# EAGLE design mixtape (EAGLE 6.5.0)

## Sheet 1 of 2
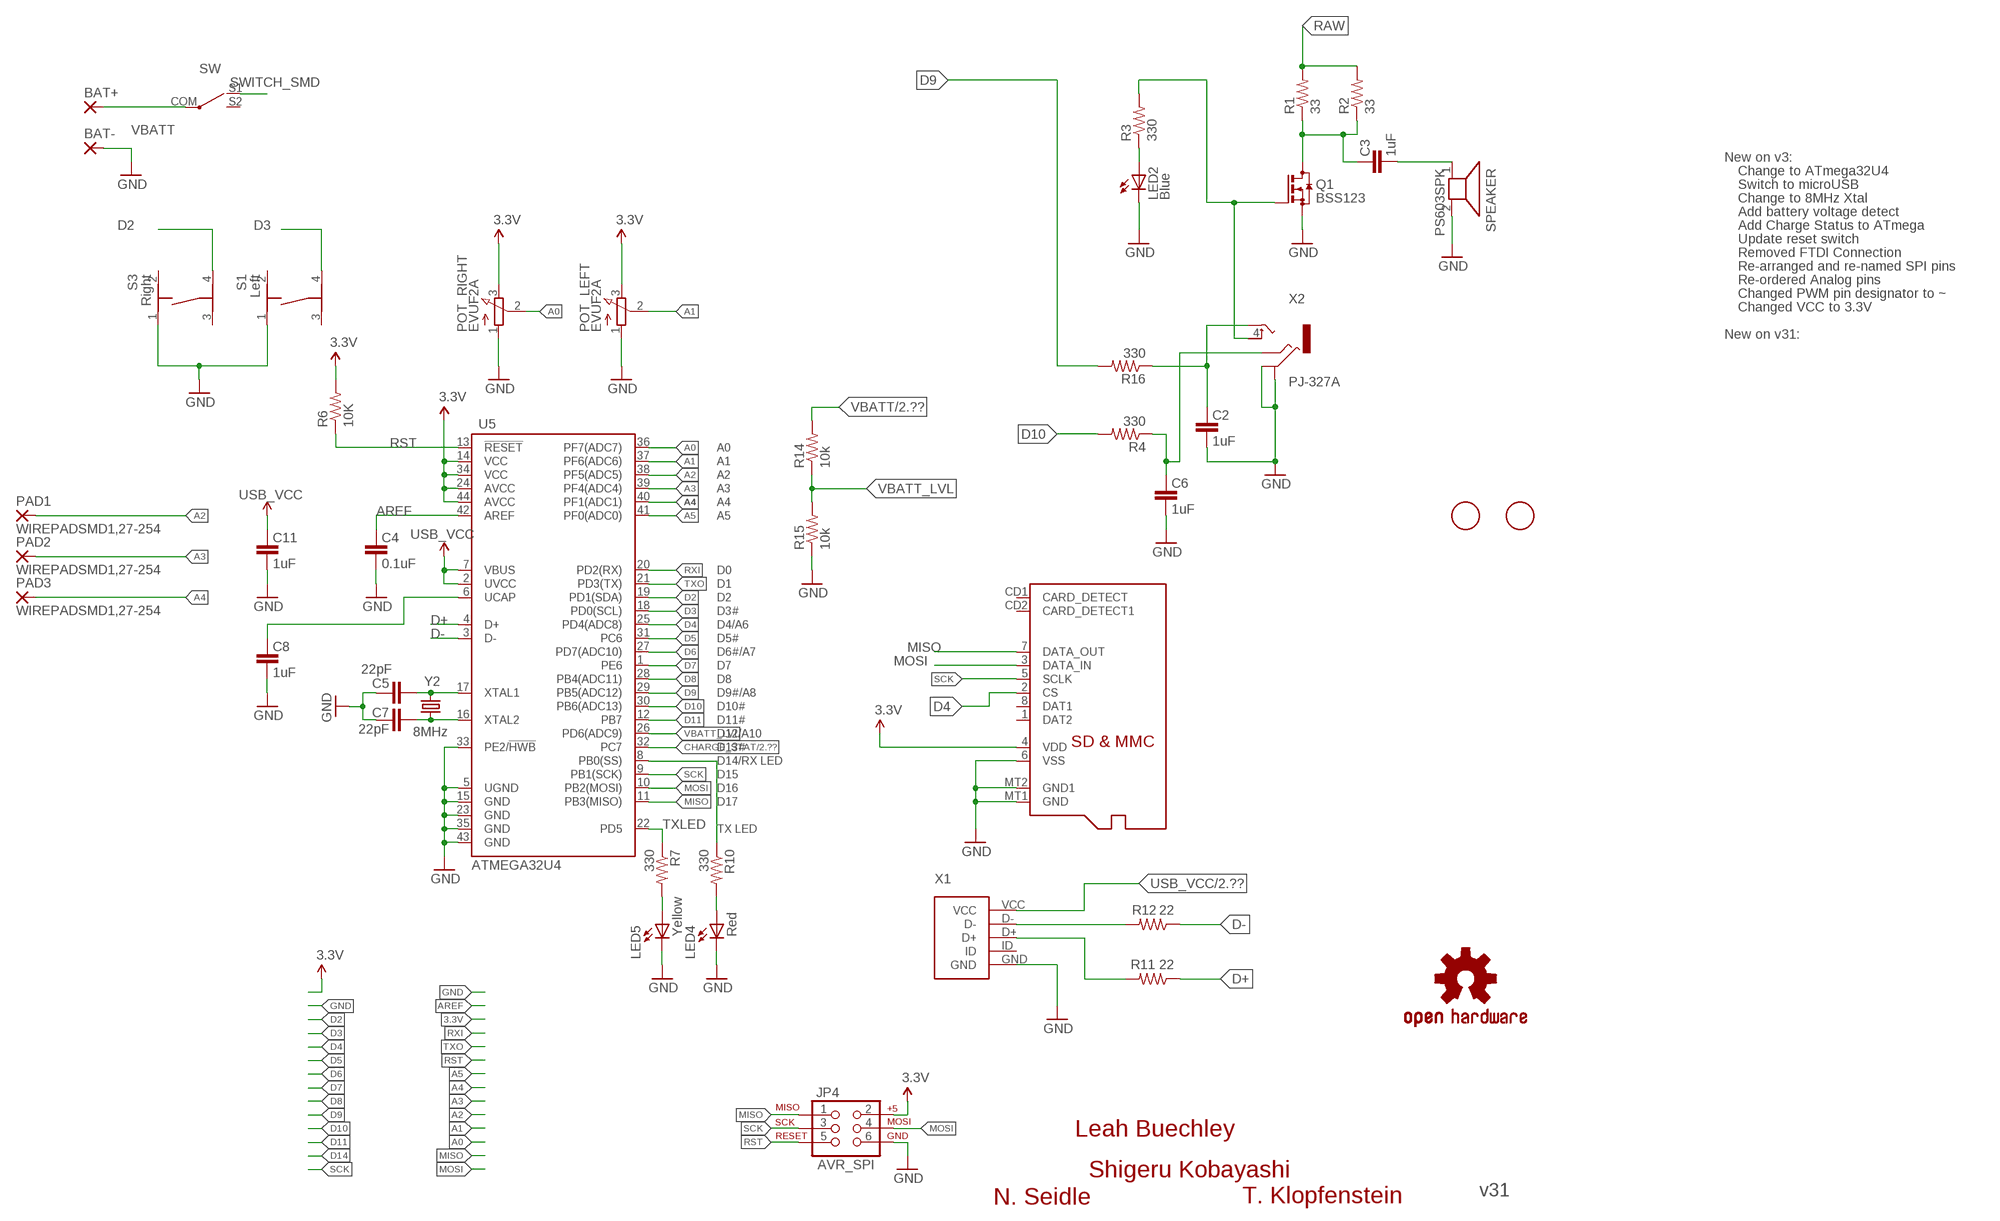
[diagram p0: schematic, sheet 1]

### Parts
BAT+  SMD5  [SMD2,54-5,08]
BAT-  SMD5  [SMD2,54-5,08]
C2  1uF  CAP0603-CAP  [0603-CAP]
C3  1uF  CAP0603-CAP  [0603-CAP]
C4  0.1uF  CAP0603-CAP  [0603-CAP]
C5  22pF  CAP0603-CAP  [0603-CAP]
C6  1uF  CAP0603-CAP  [0603-CAP]
C7  22pF  CAP0603-CAP  [0603-CAP]
C8  1uF  CAP0603-CAP  [0603-CAP]
C11  1uF  CAP0603-CAP  [0603-CAP]
JP4  AVR_SPI  AVR_SPI_PRG_6PTH  [2X3]
LED2  Blue  LED0603  [LED-0603]
LED4  Red  LED0603  [LED-0603]
LED5  Yellow  LED0603  [LED-0603]
LOGO1  OSHW-LOGOL  [OSHW-LOGO-L]
PAD1  WIREPADSMD1,27-254  [SMD1,27-2,54]
PAD2  WIREPADSMD1,27-254  [SMD1,27-2,54]
PAD3  WIREPADSMD1,27-254  [SMD1,27-2,54]
POT_LEFT  EVUF2A  [EVUF]
POT_RIGHT  EVUF2A  [EVUF]
Q1  BSS123  [SOT23]
R1  33  RESISTOR0603-RES  [0603-RES]
R2  33  RESISTOR0603-RES  [0603-RES]
R3  330  RESISTOR0603-RES  [0603-RES]
R4  330  RESISTOR0603-RES  [0603-RES]
R6  10K  RESISTOR0603-RES  [0603-RES]
R7  330  RESISTOR0603-RES  [0603-RES]
R10  330  RESISTOR0603-RES  [0603-RES]
R11  22  RESISTOR0603-RES  [0603-RES]
R12  22  RESISTOR0603-RES  [0603-RES]
R14  10k  RESISTOR0603-RES  [0603-RES]
R15  10k  RESISTOR0603-RES  [0603-RES]
R16  330  RESISTOR0603-RES  [0603-RES]
S1  Left  TASTER-9314_SMD  [TASTER-9314_SMD]
S3  Right  TASTER-9314_SMD  [TASTER-9314_SMD]
SD  MICROSD  [MICROSD]
SPEAKER  PS603SPK  [PS603]
SW  SWITCH_SMD  [SWITCH_SMD]
U5  ATMEGA32U4  ATMEGA32U41:1  [QFN-44-NOPAD_1:1]
U$1  FIDUCIAL  [FIDUCIAL_1MM]
U$2  FIDUCIAL  [FIDUCIAL_1MM]
X1  USB_B_SMD  [USB_B_SMD]
X2  PJ-327A  [PJ-327A]
Y2  8MHz  CRYSTAL5X3  [CRYSTAL-SMD-5X3]

### Nets
3.3V [vcc]: JP4.2 POT_LEFT.3(E) POT_RIGHT.3(E) R6.2 SD.4(VDD) U5.14(VCC) U5.24(AVCC) U5.34(VCC) U5.44(AVCC) ; also sheet 2
A0: POT_RIGHT.2(S) U5.36(PF7(ADC7))
A1: POT_LEFT.2(S) U5.37(PF6(ADC6))
A2: PAD1.1(P) U5.38(PF5(ADC5))
A3: PAD2.1(P) U5.39(PF4(ADC4))
A4: PAD3.1(P) U5.40(PF1(ADC1))
A5: U5.41(PF0(ADC0))
AREF: C4.2 U5.42(AREF)
CHARGE_STAT: U5.32(PC7) ; also sheet 2
D2: S3.4 U5.19(PD1(SDA))
D3: S1.4 U5.18(PD0(SCL))
D4: SD.2(CS) U5.25(PD4(ADC8))
D5: U5.31(PC6)
D6: U5.27(PD7(ADC10))
D7: U5.1(PE6)
D8: U5.28(PB4(ADC11))
D9: R16.2 U5.29(PB5(ADC12))
D10: R4.2 U5.30(PB6(ADC13))
D11: U5.12(PB7)
D14: R10.1 U5.8(PB0(SS))
D+: R11.1 U5.4(D+)
D-: R12.1 U5.3(D-)
GND: BAT-.1(P) C2.1 C4.1 C5.2 C6.1 C7.2 C8.1 C11.1 JP4.6 LED2.C LED4.C LED5.C POT_LEFT.1(A) POT_RIGHT.1(A) Q1.2(S) R15.1 S1.1 S3.1 SD.6(VSS) SD.MT1(GND) SD.MT2(GND1) SPEAKER.2 U5.5(UGND) U5.15(GND) U5.23(GND) U5.33(PE2/!HWB) U5.35(GND) U5.43(GND) X1.GND X2.1 X2.5 ; also sheet 2
MISO: JP4.1 SD.7(DATA_OUT) U5.11(PB3(MISO))
MOSI: JP4.4 SD.3(DATA_IN) U5.10(PB2(MOSI))
N$2 [vcc]: C3.2 Q1.3(D) R1.1 R2.1
N$3: C3.1 SPEAKER.1
N$4: C6.2 R4.1 X2.3
N$5: R11.2 X1.D+
N$6: LED2.A R3.1
N$7: Q1.1(G) R3.2 X2.4
N$15: LED5.A R7.2
N$16: C7.1 U5.16(XTAL2) Y2.1
N$17: C5.1 U5.17(XTAL1) Y2.3
N$19: LED4.A R10.2
N$20: R12.2 X1.D-
N$21: C2.2 R16.1 X2.2
RAW [vcc]: R1.2 R2.2 SW.S1 ; also sheet 2
RST: JP4.5 R6.1 U5.13(!RESET)
RXI: U5.20(PD2(RX))
SCK: JP4.3 SD.5(SCLK) U5.9(PB1(SCK))
TXLED: R7.1 U5.22(PD5)
TXO: U5.21(PD3(TX))
UCAP: C8.2 U5.6(UCAP)
USB_VCC: C11.2 U5.2(UVCC) U5.7(VBUS) X1.VCC ; also sheet 2
VBATT: BAT+.1(P) R14.2 SW.COM ; also sheet 2
VBATT_LVL: R14.1 R15.2 U5.26(PD6(ADC9))
Unconnected: S1.2 S1.3 S3.2 S3.3 SD.1(DAT2) SD.8(DAT1) SD.CD1(CARD_DETECT) SD.CD2(CARD_DETECT1) SW.S2 X1.ID

### Notes on the sheet
- New on v3:
- Change to ATmega32U4
- Switch to microUSB
- Change to 8MHz Xtal
- Add battery voltage detect
- Add Charge Status to ATmega
- Update reset switch
- Removed FTDI Connection
- Re-arranged and re-named SPI pins
- Re-ordered Analog pins
- Changed PWM pin designator to ~
- Changed VCC to 3.3V
- New on v31:
- Leah Buechley
- Shigeru Kobayashi
- v31
- N. Seidle | T. Klopfenstein

## Sheet 2 of 2
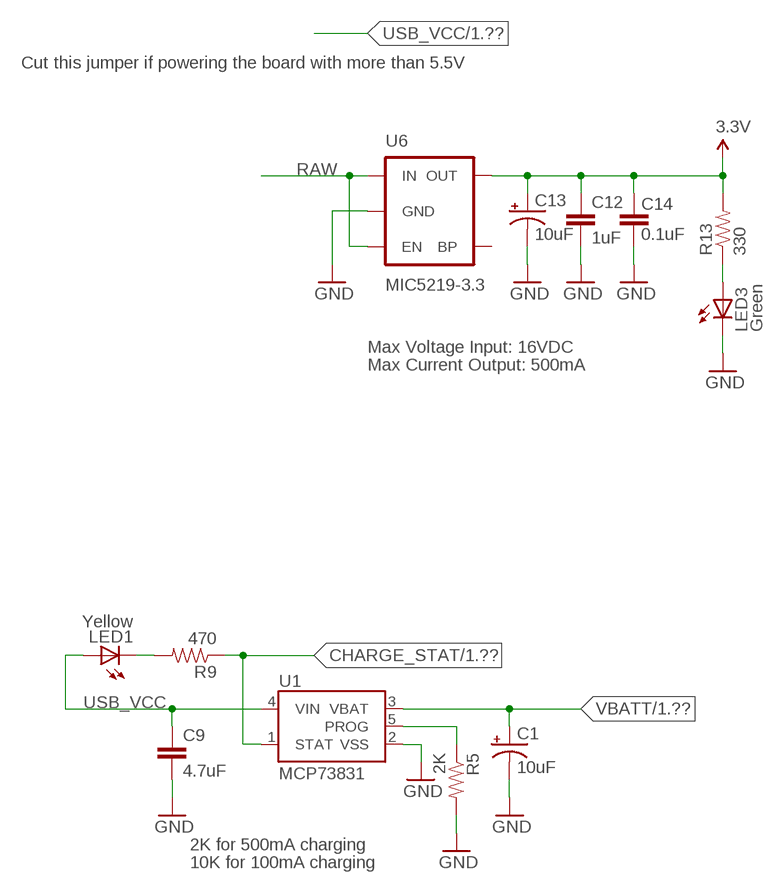
[diagram p1: schematic, sheet 2]

### Parts
C1  10uF  CAP_POL1206  [EIA3216]
C9  4.7uF  CAP0603-CAP  [0603-CAP]
C12  1uF  CAP0603-CAP  [0603-CAP]
C13  10uF  CAP_POL1206  [EIA3216]
C14  0.1uF  CAP0603-CAP  [0603-CAP]
LED1  Yellow  LED0603  [LED-0603]
LED3  Green  LED0603  [LED-0603]
R5  2K  RESISTOR0603-RES  [0603-RES]
R9  470  RESISTOR0603-RES  [0603-RES]
R13  330  RESISTOR0603-RES  [0603-RES]
U1  MCP73831  [SOT23-5]
U6  MIC5219-3.3  V_REG_LDOSMD  [SOT23-5]

### Nets
3.3V [vcc]: C12.1 C13.A(+) C14.2 R13.2 U6.5(OUT) ; also sheet 1
CHARGE_STAT: R9.1 U1.1(STAT) ; also sheet 1
GND: C1.C(-) C9.2 C12.2 C13.C(-) C14.1 LED3.C R5.2 U1.2(VSS) U6.2(GND) ; also sheet 1
N$8: LED1.C R9.2
N$11: R5.1 U1.5(PROG)
N$38: LED3.A R13.1
RAW [vcc]: U6.1(IN) U6.3(EN) ; also sheet 1
USB_VCC: C9.1 LED1.A U1.4(VIN) ; also sheet 1
VBATT: C1.A(+) U1.3(VBAT) ; also sheet 1
Unconnected: U6.4(BP)

### Notes on the sheet
- Cut this jumper if powering the board with more than 5.5V
- Max Voltage Input: 16VDC
- Max Current Output: 500mA
- 2K for 500mA charging
- 10K for 100mA charging

## Library data of the parts
BAT+ BAT- = wirepad:SMD5: SMD PAD
C1 C13 = SparkFun:CAP_POL: Capacitor Polarized These are standard SMD and PTH capacitors. Normally 10uF, 47uF, and 100uF in electrolytic and tantalum varieties. Always verify the external diameter of the through hole cap, it varies with capacity, voltage, and manufacturer. The EIA devices should be standard.
C2-C9 C11 C12 C14 = SparkFun-Capacitors:CAP: Capacitor Standard 0603 ceramic capacitor, and 0.1" leaded capacitor.
JP4 = SparkFun:AVR_SPI_PRG_6: AVR ISP 6 Pin This is the reduced ISP connector for AVR programming. Common on Arduino. This footprint will take up less PCB space and can be used with a 10-pin to 6-pin adapter such as SKU: BOB-08508
LED1-LED5 = SparkFun:LED: LEDs Standard schematic elements and footprints for 5mm, 3mm, 1206, and 0603 sized LEDs. 5mm - Spark Fun Electronics SKU : COM-00529 (and others)
LOGO1 = SparkFun-Aesthetics:OSHW-LOGO: Open Source Hardware Logo This logo indicates the piece of hardware it is found on incorporates a OSHW license and/or adheres to the definition of open source hardware found here: http://freedomdefined.org/OSHW
PAD1-PAD3 = wirepad:WIREPAD: Wire PAD connect wire on PCB
POT_LEFT POT_RIGHT = Gaudi:EVU: 9 mm Square Rotary Potentiometers Source: Panasonic
Q1 = transistor-small-signal:BSS123: N-CHANNEL MOS FET
R1-R7 R9-R16 = SparkFun-Resistors:RESISTOR: Resistor Basic schematic elements and footprints for 0603, 1206, and PTH resistors.
S1 S3 = Gaudi:TASTER-9314_SMD; PN: UG_SW
SD = adafruit:MICROSD: Micro-SD / Transflash card holder with SPI pinout For the 3M # 2908-05WB-MG and/or 4UCON #19656 push-push type
SPEAKER = adafruit:PS603: PS603 Small 8 ohm speaker, from Mouser. Can SMT solder to board http://www.ladyada.net/library/pcb/eaglelibrary.html
SW = Gaudi:SWITCH_SMD
U1 = SparkFun:MCP73831: Microchip's MCP73831 Miniature single cell, fully integrated Li-Ion, Li-polymer charge management controller http://ww1.microchip.com/downloads/en/DeviceDoc/21984a.pdf
U5 = Testing:ATMEGA32U4: Atmel 44-pin 8-bit Microcontroller with 32KBytes of ISP Flash and USB Controller
U6 = SparkFun:V_REG_LDO: Voltage Regulator LDO Standard 150mA LDO voltage regulator in SOT-23 layout. Micrel part MIC5205. BP (by-pass) pin is used to lower output noise with 470pF cap.
U$1 U$2 = adafruit:FIDUCIAL: For use by pick and place machines to calibrate the vision/machine, 1mm By microbuilder.eu
X1 = Gaudi:USB_B_SMD
X2 = Gaudi:PJ-327A
Y2 = SparkFun:CRYSTAL: Crystals Various standard crystals. Proven footprints. Spark Fun Electronics SKU : COM-00534

## Net classes
0 Default: width 0.203 mm
2 LEDPower: width 0.203 mm
3 ButtonSignal: width 0.203 mm

## Board
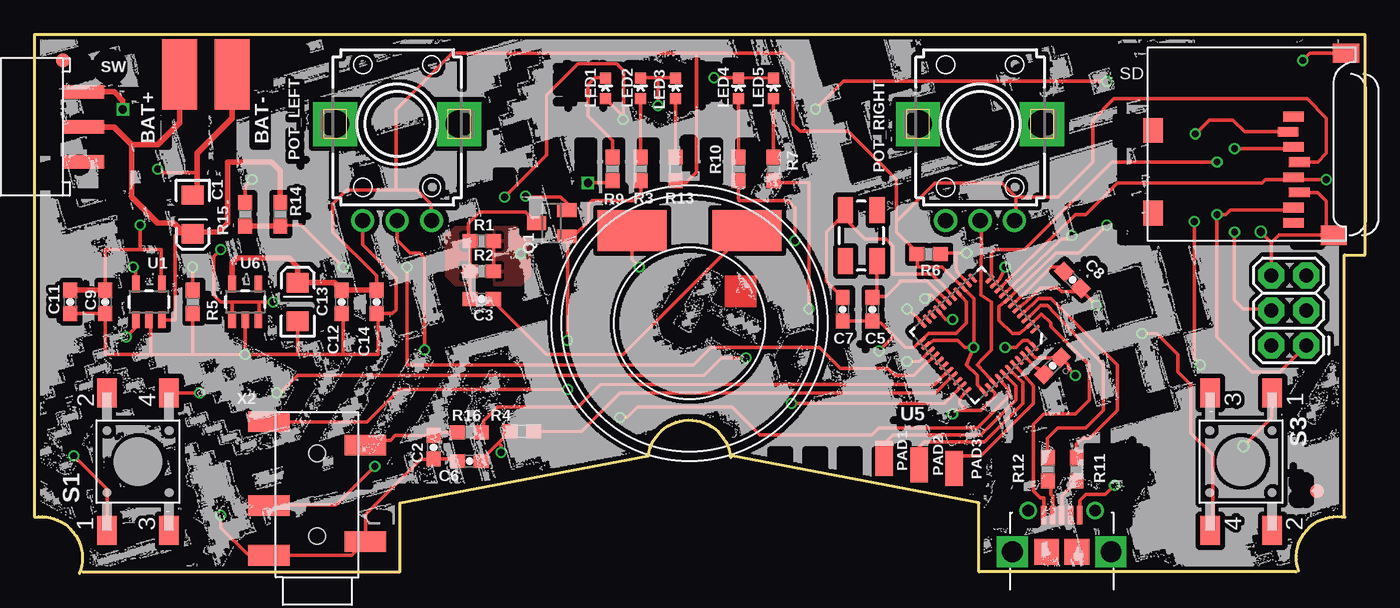
[diagram p2: board, top side]
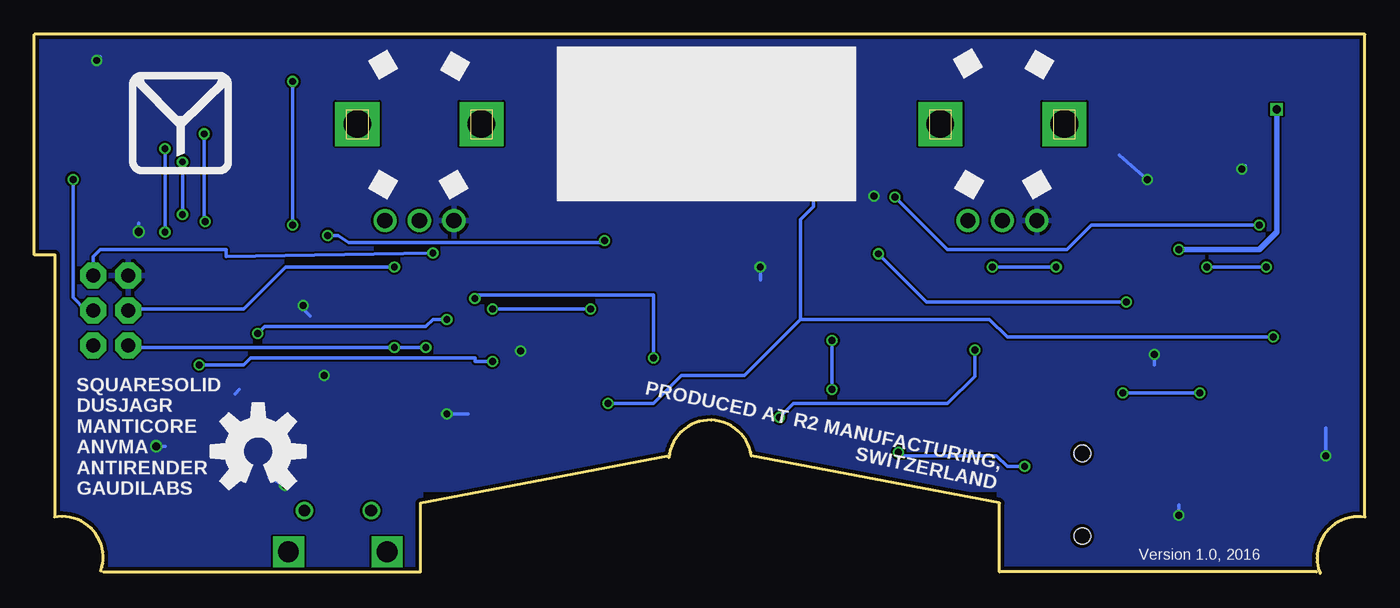
[diagram p3: board, bottom side, seen from below]

Size 96.51 x 39.12 mm. Coordinates in mm from the lower left corner, seen from the top.
Outline: 0.01,4.12 0.01,39.12 96.51,39.12 96.51,23.12 95.01,23.12 95.01,4.12
Outline: 44.5,8.53 26.51,5.12 26.51,0.12 3.51,0.12
Outline: 50.6,8.53 68.51,5.12 68.51,0.12 91.51,0.12
Outline: 0,4.09 arc-121 3.26,0
Outline: 91.7,0.17 arc-120 95.07,4.09
Outline: 44.52,8.52 arc-167 50.49,8.41
Copper layers (1*2*15*16): Top 0.035mm / dielectric 0.2mm / Route2 0.0175mm / dielectric 1.1mm / Route15 0.0175mm / dielectric 0.2mm / Bottom 0.035mm
Design rules "SeeedStudio_DRU_no_angle_20130527": minimum track width 6mil, minimum drill 12mil, track to track 6mil, track to pad 6mil, pad to pad 6mil, via to via 6mil, smd to smd 0mil, copper to edge 10mil, drill to drill 10mil, minimum pad ring 6mil, minimum via ring 6mil, stop-mask expansion 2mil, vias tented up to drill 25mil, thermal gap 10mil

### Footprints (pad centres in the part's own frame; a part is rotated, then mirrored left to right if it is on the bottom)
SMD2,54-5,08 = smd 2.54 x 5.08: 1 0,0
EIA3216 = smd 1.4 x 1.6: A 1.4,0; C -1.4,0
0603-CAP = smd 1.1 x 1: 1 -0.85,0; 2 0.85,0
2X3 = drill 1.016 pad 1.88 octagon: 1 0,0; 2 0,2.54; 3 2.54,0; 4 2.54,2.54; 5 5.08,0; 6 5.08,2.54
LED-0603 = smd 0.8 x 0.8: A 0,-0.75; C 0,0.75
SMD1,27-2,54 = smd 1.27 x 2.54: 1 0,0
EVUF = drill 1.1 pad 1.676: 1 -2.5,-7; 2 0,-7; 3 2.5,-7 | drill 2 pad 3.2 square: M1 4.5,0; M2 -4.5,0
SOT23 = smd 1 x 1.4: 1 -0.95,-1.1; 2 0.95,-1.1; 3 0,1.1
0603-RES = smd 1.1 x 1: 1 -0.85,0; 2 0.85,0
TASTER-9314_SMD = smd 2.1 x 1.4: 1 -5,2.25; 2 5,2.25; 3 -5,-2.25; 4 5,-2.25
MICROSD = smd 0.7 x 1.5: 1 9,-10.64; 2 7.9,-10.24; 3 6.8,-10.64; 4 5.7,-11.04; 5 4.6,-10.64; 6 3.5,-11.04; 7 2.4,-10.64; 8 1.3,-10.64 | smd 1.8 x 1.4: CD1 2,-0.44; CD2 8,-0.44 | smd 1.4 x 1.9: MT1 0.4,-13.54; MT2 13.6,-14.44
PS603 = smd 5 x 3: 1 -4.184,-6.738; 2 4.184,-6.738
SWITCH_SMD = smd 3 x 1: COM 0,0; S1 0,2.54; S2 0,-2.54
SOT23-5 = smd 0.55 x 1.2: 1 -0.95,-1.3; 2 0,-1.3; 3 0.95,-1.3; 4 0.95,1.3; 5 -0.95,1.3
QFN-44-NOPAD_1:1 = smd 0.8 x 0.3: 1 -3.337,2.458; 2 -3.337,1.958; 3 -3.337,1.479; 4 -3.337,0.979; 5 -3.337,0.5; 6 -3.337,0; 7 -3.337,-0.5; 8 -3.337,-0.979; 9 -3.337,-1.479; 10 -3.337,-1.958; 11 -3.337,-2.458; 23 3.337,-2.458; 24 3.337,-1.958; 25 3.337,-1.479; 26 3.337,-0.979; 27 3.337,-0.5; 28 3.337,0; 29 3.337,0.5; 30 3.337,0.979; 31 3.337,1.479; 32 3.337,1.958; 33 3.337,2.458 | smd 0.3 x 0.8: 12 -2.458,-3.337; 13 -1.958,-3.337; 14 -1.479,-3.337; 15 -0.979,-3.337; 16 -0.5,-3.337; 17 0,-3.337; 18 0.5,-3.337; 19 0.979,-3.337; 20 1.479,-3.337; 21 1.958,-3.337; 22 2.458,-3.337; 34 2.458,3.337; 35 1.958,3.337; 36 1.479,3.337; 37 0.979,3.337; 38 0.5,3.337; 39 0,3.337; 40 -0.5,3.337; 41 -0.979,3.337; 42 -1.479,3.337; 43 -1.958,3.337; 44 -2.458,3.337
FIDUCIAL_1MM = smd 1 x 1: 1 0,0
USB_B_SMD = smd 0.4 x 1.35: D+ 0,0; D- -0.65,0; GND 1.3,0; ID 0.65,0; VCC -1.3,0 | smd 1.8 x 1.9: P$6 -1.1,-2.675; P$7 1.1,-2.675 | drill 0.85: P$8 -2.425,0.325; P$9 2.425,0.325 | drill 1.5 pad 2 square: P$10 -3.575,-2.675; P$11 3.575,-2.675
PJ-327A = smd 1.5 x 3: 1 2.6,-3.5; 2 9.6,-3.5; 3 5.2,3.5; 4 11.3,3.5; 5 1.6,3.5 | hole 1.2: 3,0; 9,0
CRYSTAL-SMD-5X3 = smd 1.9 x 1.1: 1 -1.85,-1.15; 2 1.85,-1.15; 3 1.85,1.15; 4 -1.85,1.15

### Placement (x,y rotation side)
BAT+  10.53,36.22 0 top
BAT-  14.34,36.22 0 top
C1  11.48,26.06 270 top
C2  28.94,9.17 90 top
C3  32.44,19.91 180 top
C4  73.85,15.07 225 top
C5  60.78,19.17 270 top
C6  31.55,8.15 0 top
C7  58.62,19.17 270 top
C8  75.29,21.3 135 top
C9  5.13,19.71 270 top
C11  2.59,19.71 90 top
C12  22.28,19.71 270 top
C13  19.1,19.71 90 top
C14  24.82,19.71 90 top
JP4  92.26,16.56 90 top
LED1  41.42,35.21 0 top
LED2  43.96,35.21 0 top
LED3  46.5,35.21 0 top
LED4  51.07,35.21 0 top
LED5  53.61,35.21 0 top
LOGO1  80.29,8.87 0 bottom
PAD1  61.65,8.34 0 top
PAD2  64.19,7.9 0 top
PAD3  66.73,7.64 0 top
POT_LEFT  26.31,32.62 0 top
POT_RIGHT  68.59,32.62 0 top
Q1  37.52,25.42 90 top
R1  32.44,24.12 0 top
R2  32.44,21.93 0 top
R3  43.96,29.37 270 top
R4  35.36,10.31 0 top
R5  11.48,19.71 270 top
R6  64.85,23.18 180 top
R7  53.61,29.37 90 top
R9  41.93,29.37 90 top
R10  51.07,29.37 90 top
R11  75.59,7.57 270 top
R12  73.5,7.57 270 top
R13  46.5,29.37 270 top
R14  17.83,26.06 90 top
R15  15.29,26.06 270 top
R16  31.55,10.25 0 top
S1  7.51,8.12 90 top
S3  87.51,8.12 270 top
SD  80.7,24.15 90 top
SPEAKER  47.51,18.15 180 top
SW  3.54,32.41 0 top
U1  8.31,19.71 0 top
U5  68.46,17.3 222 top
U6  15.29,19.71 0 top
U$1  2.08,37.24 0 top
U$2  93.02,5.99 0 top
U$4  FIO_LOGOV2  [FUNNEL_LOGO_BOTTOM_V2]  85.9,32.66 0 top
X1  74.51,4.25 0 top
X2  20.51,-0.28 90 top
Y2  59.97,24.52 270 top

### Tracks (layer width: path | path; a pad name or v marks a point on that pad's centre or on a via)
3.3V  (via drill 0.5)
  Top 0.2: 91.75,29.87 SD.4
  Top 0.254: 68.12,16.46 v68.12,16.41 67.49,16.41 66.98,16.92 65.2,16.92 U5.24 | 68.12,16.46 68.12,19.97 U5.14 65.84,22.25 64.06,22.25 64.06,23.12 R6.2 63.81,23.01 63.81,23.52 62.54,24.79 62.54,25.55 | 68.12,16.46 67.62,15.14 68.38,14.38 68.38,13.69 U5.34 | 62.54,25.55 65.33,28.35 70.16,28.35 71.17,27.33 | 71.17,27.33 71.17,25.7 POT_RIGHT.3 | 62.54,25.55 62.54,28.6 59.01,32.12 55.51,32.12 55.01,32.62 55.01,37.12 54.39,37.74 48.01,37.74 | v70.41,16.41 71.17,16.41 71.68,16.92 72.07,16.92 U5.44 | 71.17,27.33 74.22,27.33 76.76,29.87 76.76,32.92 78.28,34.44 92.32,34.44 93.71,33.04 93.71,30.5 93.08,29.87 91.75,29.87 | 48.01,37.74 30.28,37.74 26.21,33.68 26.21,27.84 | C14.2 24.82,21.61 21.64,24.79 21.64,26.82 22.66,27.84 26.21,27.84 | 26.21,27.84 27.74,27.84 28.75,26.82 28.75,25.68 POT_LEFT.3 | R13.2 46.67,28.35 47.26,28.35 48.03,29.12 48.03,37.73 48.01,37.74
  Top 0.406: U6.5 14.34,22.57 14.66,22.88 18.47,22.88 19.1,22.25 C13.A 21.73,21.11 C12.1 C14.2
  Bottom 0.254: v68.12,16.41 v70.41,16.41 89.57,16.41 JP4.2
A0
  Top 0.254: U5.36 68.96,14.56 68.38,15.14 68.6,15.43 69.39,16.22 69.39,19.71 68.67,20.22 68.67,25.58 POT_RIGHT.2
A1  (via drill 0.5)
  Top 0.254: U5.37 70.47,13.55 70.66,13.36 70.66,12.85 68.38,10.57 61.27,10.57 60.76,10.06 52.63,10.06 50.6,12.09 43.74,12.09 42.98,11.33 v42.47,11.33 | POT_LEFT.2 26.31,24.18 27.23,23.27 27.93,23.27 28.31,22.88 v28.31,16.22
  Bottom 0.254: v28.31,16.22 28.31,14.31 30.28,12.34 41.45,12.34 v42.47,11.33
A2
  Top 0.254: U5.38 70.32,14.47 71.17,13.61 71.17,12.6 68.63,10.06 62.28,10.06 61.77,9.55 61.77,7.77 PAD1.1
A3
  Top 0.254: U5.39 71.23,14.32 71.68,13.87 71.68,12.34 68.89,9.55 64.57,9.55 64.06,9.04 64.06,7.77 PAD2.1
A4
  Top 0.254: U5.40 71.57,14.61 72.44,13.61 72.44,12.34 68.63,8.53 66.85,8.53 66.6,8.28 PAD3.1
AREF
  Top 0.254: U5.42 71.79,15.79 72.7,14.88 72.84,14.88 C4.2
CHARGE_STAT  (via drill 0.5, 0.6)
  Top 0.254: 67.03,13.41 U5.32 66.01,12.34 v54.92,12.34 | U1.1 7.36,17.87 v6.66,17.17 | v40.15,28.35 41.64,28.35 R9.1
  Bottom 0.254: v6.66,17.17 25.96,17.17 27.23,18.44 40.95,18.44 | 40.95,18.44 40.95,25.69 40.01,26.62 40.01,28.21 v40.15,28.35 | 40.95,18.44 45.01,14.38 49.58,14.38 51.61,12.34 v54.92,12.34
D2  (via drill 0.5)
  Top 0.254: U5.19 66,18.53 66.09,18.44 v66.6,18.44 | S3.4 85.46,3.32 85.46,8.6 83.87,10.18 83.87,13.68 82.92,14.63 82.92,15.9 81.39,17.42 v80.32,17.42
  Bottom 0.254: v66.6,18.44 67.62,18.44 68.12,17.93 79.81,17.93 v80.32,17.42
D3  (via drill 0.5)
  Top 0.254: U5.18 65.6,19.69 65.08,20.22 64.82,20.22 v64.57,19.96 | S1.4 v11.99,13.11 | v51.61,15.65 49.84,15.65 48.57,14.38 19.1,14.38 17.83,13.11 v17.58,13.11
  Bottom 0.254: v51.61,15.65 51.61,20.22 64.31,20.22 v64.57,19.96 | v11.99,13.11 v17.58,13.11
D4  (via drill 0.5)
  Top 0.254: U5.25 64.73,15.94 64.19,15.39 v63.3,15.39 | SD.2 87.78,32.05 86.92,32.92 85.21,32.92 v84.19,31.9 | v84.13,25.55 84.13,15.65 v84.57,15.14
  Bottom 0.254: v63.3,15.39 64.57,15.39 64.57,15.65 80.82,15.65 81.33,15.14 v84.57,15.14 | v84.19,31.9 84.19,25.61 v84.13,25.55
D9
  Top 0.254: U5.29 66.27,14.7 65.3,13.74 41.07,13.74 39.42,12.09 33.58,12.09 32.56,11.07 32.56,10.41 R16.2
D10
  Top 0.254: 66.59,14.34 U5.30 66.6,14.34 65.36,13.11 42.47,13.11 39.68,10.31 R4.2
D14  (via drill 0.5)
  Top 0.254: U5.8 70.96,20.9 74.47,24.28 74.98,24.28 v75.24,24.54 | v55.17,24.15 55.17,26.57 54.66,27.08 51.2,27.08 | 51.2,27.08 51.11,27.08 | R10.1 51.07,27.2 51.2,27.08
  Bottom 0.254: v75.24,24.54 74.47,24.54 73.71,24.03 55.17,24.03 v55.17,24.15
D+
  Top 0.254: U5.4 72.48,19.62 72.82,19.96 73.71,19.96 78.54,15.14 78.54,11.84 76.51,9.8 76,9.8 75.59,9.39 R11.1
D-
  Top 0.254: U5.3 71.93,18.44 72.95,19.46 73.46,19.46 77.52,15.14 77.52,11.84 76.25,10.57 74.22,10.57 73.46,9.8 73.46,8.46 R12.1 73.52,8.44
GND  (via drill 0.5, 0.6)
  Top 0.254: U5.43 72.59,15.63 72.7,15.65 74.42,15.65 C4.1 | U5.5 72.19,19.96 72.95,20.73 74.22,20.73 74.47,20.47 75.66,20.47 C8.1 75.89,20.58 v77.01,19.46 | U5.15 67.33,19.99 67.62,19.71 67.62,18.19 66.85,17.42 64.86,17.42 U5.23 64.3,16.9 63.81,16.41 63.17,16.41 62.31,17.26 | C4.1 | U5.33 67.37,12.98 67.11,12.6 67.11,12.34 67.62,11.84 | 67.62,11.84 68.63,11.84 69.65,12.85 69.65,13.1 U5.35 | SD.MT1 93.71,24.55 | 93.71,24.55 90.26,24.55 89.72,24.02 | 89.71,23.27 JP4.6 89.72,24.02 | POT_LEFT.1 23.81,23.89 26.21,21.49 26.21,19.11 25.96,18.86 C14.1 24.94,18.73 24.94,15.9 22.4,15.9 | C11.1 C9.2 5.13,15.9 8.43,15.9 | R5.2 11.48,15.9 | 11.48,15.9 8.43,15.9 | 8.43,15.9 8.43,18.28 U1.2 | 11.48,15.9 v15.29,15.9 | v15.29,15.9 U6.2 | v15.29,15.9 19.1,15.9 | 19.1,15.9 C13.C | 19.1,15.9 22.4,15.9 | 22.4,15.9 22.4,18.73 C12.2 | C1.C 11.75,27.73 11.75,29.12 11.74,29.11 9.2,29.11 v8.94,29.36 | R15.1 15.29,28.09 v15.8,28.6 | 67.62,11.84 66.85,11.84 v66.6,11.58 | C7.2 C5.2 60.92,18.19 61.39,18.19 62.31,17.26 | LED5.C v49.3,35.97 51.06,35.97 LED4.C | S1.1 5.26,6.12 v2.85,8.53 | v45.23,33.94 45.23,35.97 | 45.23,35.97 46.49,35.97 LED3.C | 45.23,35.97 43.97,35.97 LED2.C | C4.1 74.98,15.14 74.98,14.88 v75.49,14.38 | 62.31,17.26 62.31,17.2 v61.27,16.15 | SD.MT2 92.52,37.75 v92,37.24 | SD.6 93.07,27.65 93.71,27.01 93.71,24.55 | S3.1 89.76,11.31 v87.68,9.23 | 89.72,24.02 v88.95,24.79 | SPEAKER.2 43.33,22.79 v43.87,22.25 | Q1.2 38.62,26.86 38.15,27.33 35.67,27.33 v35.61,27.39 | 23.01,1.72 X2.1 | 16.41,1.56 X2.5 23.01,1.32 X2.1 | 16.41,1.56 16.01,1.72 | X2.1 24.01,4.3 27.99,8.28 28.9,8.28 C2.1 30.53,8.32 C6.1 | v78.34,6.41 77.67,5.74 76.25,5.74 75.81,5.3 X1.GND
  Top 0.254: v13.51,4.22 13.51,3.33 15.42,1.42 16.28,1.42 16.41,1.56
  Top 0.406: C1.C 11.8,27.78 11.8,30.5 14.34,33.04 BAT-.1
  Bottom 0.254: v77.01,19.46 77.01,19.2 76.51,18.69 | v61.27,16.15 61.27,15.9 | v92,37.24 91.75,37.49 | v8.94,29.36 8.69,29.62 | v15.8,28.6 17.83,30.38 | v2.85,8.53 2.85,10.57 | v15.29,15.9 15.29,15.14 | v66.6,11.58 65.08,11.58 | v49.3,35.97 49.51,35.27 49.84,34.95 | v87.68,9.23 87.05,9.23 | v88.95,24.79 88.95,25.42 | 81.97,13.04 81.65,13.36 | v43.87,22.25 43.87,21.3 | v78.34,6.41 79.49,6.95 | v13.51,4.22 13.51,4.98
  pour Bottom: 0.01,0.12 0.01,39.12 96.51,39.12 96.51,23.12 95.01,23.12 95.01,0.12 68.51,0.12 68.51,6.12 26.51,6.12 26.51,0.12
MISO  (via drill 0.5)
  Top 0.254: U5.11 69.39,21.49 69.39,23.27 69.65,23.52 71.81,23.52 78.16,29.87 v85.78,29.87 | JP4.1 90.33,14.63 88.32,14.63 85.78,17.17 v85.78,26.06 86.41,26.06 86.73,26.38 91.16,26.38 SD.7
  Bottom 0.254: v85.78,26.06 v85.78,29.87
MOSI  (via drill 0.5)
  Top 0.254: U5.10 70.04,21.37 v70.41,22.25 | v87.05,24.79 87.05,19.84 87.68,19.2 89.62,19.2 JP4.4 | v87.05,30.82 91.2,30.82 SD.3
  Bottom 0.254: JP4.4 89.62,19.2 81.33,19.2 78.28,22.25 v70.41,22.25 | v87.05,24.79 v87.05,30.82
N$2
  Top 0.254: C3.2 R2.1 R1.1 31.48,24.23 31.48,25.42 32.29,26.23 35.61,26.23 Q1.3
  Top 0.406: Q1.3 35.93,25.42
  pour Top: 31.48,25.11 30.53,25.11 29.9,24.47 29.9,21.61 30.53,20.98 31.48,20.98
N$3
  Top 0.254: SPEAKER.1 42.7,15.9 37.14,15.9 33.29,19.75 C3.1
N$4  (via drill 0.5)
  Top 0.254: 17.18,5.49 X2.3 17.07,4.98 21.9,4.98 v24.69,7.77 | C6.2 32.4,8.2 33.66,9.47 | 33.66,9.47 R4.1 | v33.83,8.79 33.83,9.3 33.66,9.47
  Bottom 0.254: v24.69,7.77 25.96,7.77 26.72,8.53 33.58,8.53 v33.83,8.79
N$5
  Top 0.254: X1.D+ 74.51,5.64 R11.2
N$6
  Top 0.254: LED2.A R3.1
N$7  (via drill 0.5)
  Top 0.254: v38.66,13.36 26.47,13.36 24.13,11.02 X2.4 | v38.66,16.92 38.66,24.43 Q1.1 39.11,24.47 40.18,25.55 40.18,26.82 40.44,27.08 43.49,27.08 43.99,27.58 43.99,28.49 R3.2
  Bottom 0.254: v38.66,13.36 v38.66,16.92
N$8
  Top 0.254: 41.17,35.97 41.66,35.97 LED1.C 41.41,35.97 40.66,35.97 40.15,35.47 40.15,33.18 41.93,31.4 R9.2
N$11  (via drill 0.5)
  Top 0.254: U1.5 7.36,22.19 v7.16,22.25 | v11.48,22.25 R5.1
  Top 0.406: U1.5 7.36,21.3
  Bottom 0.254: v7.16,22.25 v11.48,22.25
N$15
  Top 0.254: LED5.A R7.2
N$16
  Top 0.254: Y2.1 58.82,26.16 58.6,25.93 | 58.6,25.93 57.46,24.79 57.46,21.19 C7.1 | U5.16 65.96,20.86 65.08,21.74 62.28,21.74 62.28,23.77 61.77,24.28 60.25,24.28 58.6,25.93
N$17
  Top 0.254: Y2.3 61.12,20.36 C5.1 60.85,20.09 61.77,20.09 62.79,21.11 62.79,21.23 64.77,21.23 U5.17
N$19
  Top 0.254: LED4.A R10.2
N$20
  Top 0.254: 73.52,6.7 R12.2 73.71,6.5 73.71,5.74 73.86,5.59 X1.D-
N$21
  Top 0.254: R16.1 29.17,10.25 C2.2 26.17,10.02 25.83,9.68 24.37,9.68 X2.2
N$38
  Top 0.254: LED3.A R13.1
RAW  (via drill 0.5, 0.6)
  Top 0.254: U6.1 14.34,19.64 14.28,19.71 | 14.28,19.71 16.31,19.71 | 16.31,19.71 16.31,18.48 U6.3 | 14.28,19.71 13.51,19.71 13.01,20.22 13.01,23.01 v13.51,23.52 | 16.31,19.71 v17.32,19.71 | R1.2 R2.2
  Top 0.406: v6.4,33.68 6.4,34.31 5.77,34.95 SW.S1
  Bottom 0.254: v17.32,19.71 31.8,19.71 v35.29,23.2
  Bottom 0.406: v13.51,23.52 7.67,23.52 6.4,24.79 v6.4,33.68
  pour Top: 33.39,25.11 33.39,20.98 35.29,20.98 35.93,21.61 35.93,24.15 34.98,24.47 34.98,25.11
RST  (via drill 0.5)
  Top 0.254: U5.13 66.92,21.93 66.85,22.25 66.85,23.25 | 66.85,23.25 66.85,23.27 v67.62,23.27 | 66.85,23.25 65.78,23.25 R6.1
  Bottom 0.254: v67.62,23.27 82.6,23.01 82.6,23.52 91.75,23.52 92.25,23.01 JP4.5
SCK  (via drill 0.5)
  Top 0.254: U5.9 70.32,21.02 75.49,26.06 76.25,26.06 78.54,28.35 89.02,28.35 89.27,28.6 91.18,28.6 SD.5 91.49,28.6 v93.71,28.6
  Bottom 0.254: JP4.3 92.79,19.1 93.71,20.03 v93.71,28.6
TXLED  (via drill 0.5)
  Top 0.254: U5.22 63.98,18.65 v63.3,19.2 | v56.19,19.2 56.19,27.84 56.17,28.35 53.65,28.35 R7.1
  Bottom 0.254: v63.3,19.2 v56.19,19.2
UCAP
  Top 0.254: U5.6 71.76,20.3 73.71,22.25 74.35,22.25 C8.2
USB_VCC  (via drill 0.5)
  Top 0.254: C9.1 5.13,23.52 7.67,23.52 | U1.4 9.2,21.07 9.2,23.52 7.67,23.52 | v77.78,25.3 75.74,23.27 74.09,23.27 70.99,20.29 U5.7 69.97,19.39 69.97,18.37 70.92,17.42 71.43,17.42 U5.2 73.05,18.84 73.71,18.19 73.71,17.93 76.51,15.14 76.51,12.6 75.49,11.58 73.2,11.58 72.44,10.82 72.44,5.99 72.96,5.48 73.21,5.48 X1.VCC | v77.78,35.71 58.69,35.71 v56.66,33.69 | LED1.A 42.69,33.19 v42.69,32.93 42.72,32.96 42.72,36.47 42.22,36.98 39.42,36.98 37.14,34.7 37.14,30.38 v34.09,27.33 | 7.67,23.52 v7.67,25.3
  Top 0.406: C11.2 C9.1
  Bottom 0.254: v77.78,25.3 v77.78,35.71 | v42.69,32.93 55.9,32.93 v56.66,33.69 | v7.67,25.3 19.86,25.3 21.64,23.52 30.28,23.52 v34.09,27.33
VBATT
  Top 0.254: U1.3 10.18,18.41 10.21,18.44 10.21,24.54 10.34,24.66 10.85,24.66 C1.A
  Top 0.406: R14.2 17.83,29.23 17.2,29.87 14.02,29.87 14.02,25.42 13.39,24.79 11.61,24.79 C1.A | SW.COM 5.77,32.41 7.04,31.14 | 7.04,31.14 7.04,27.33 8.94,25.42 10.08,25.42 10.85,24.66 | 7.04,31.14 8.94,31.14 10.53,32.73 BAT+.1
VBATT_LVL  (via drill 0.5)
  Top 0.254: U5.26 64.59,15.16 63.81,14.38 62.41,14.38 61.9,14.88 58.47,14.88 56.95,16.41 49.07,16.41 47.8,15.14 27.04,15.14 v27.04,22.25 | R14.1 18.85,25.3 19.36,25.3 v22.4,22.25
  Top 0.406: R15.2 R14.1
  Bottom 0.254: v22.4,22.25 v27.04,22.25
(copper drawn outside any net)
  shapes: Top area x1

### Text on the board
bPlace: PRODUCED AT R2 MANUFACTURING, / SWITZERLAND | SQUARESOLID / DUSJAGR / MANTICORE / ANVMA / ANTIRENDER / GAUDILABS | Version 1.0, 2016